# EAGLE design FabEEG_v6 (EAGLE 6.2)
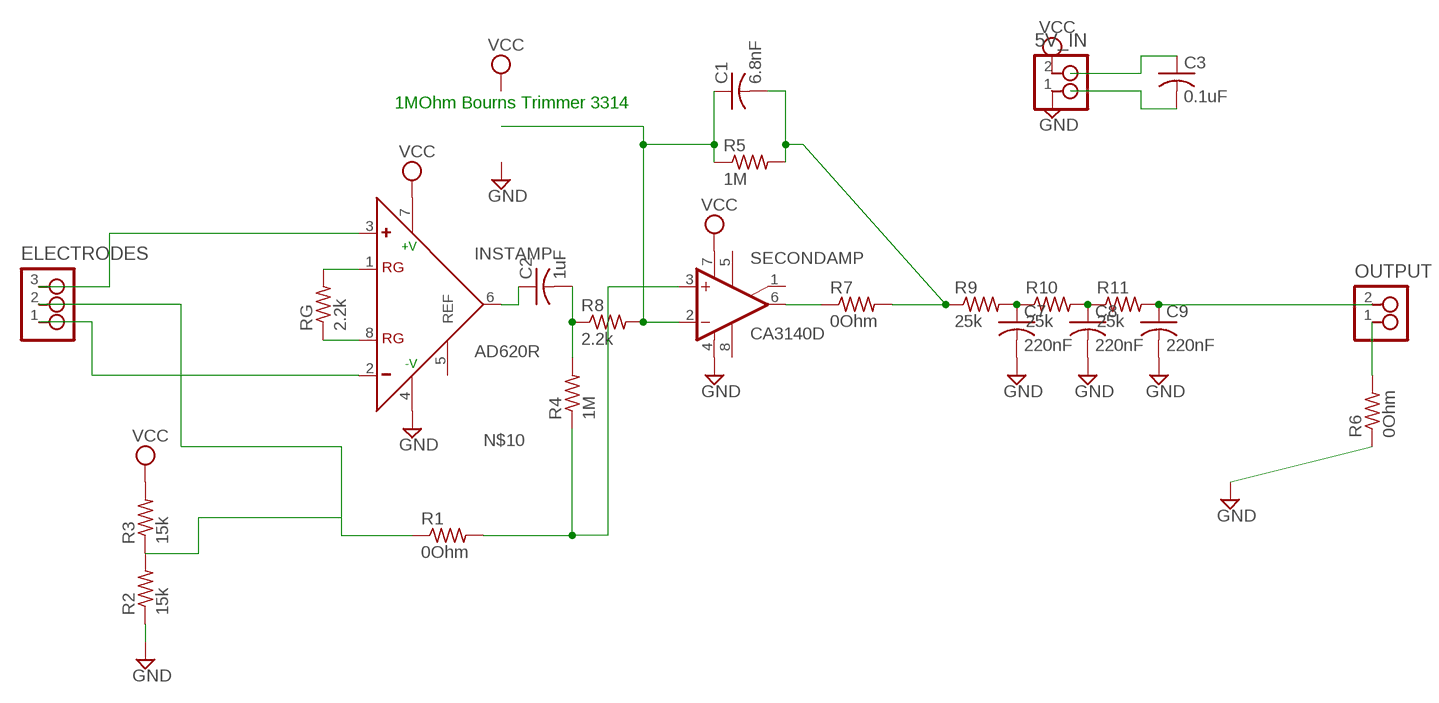
[diagram p0: schematic, sheet 1]

## Parts
5V_IN  2_PIN_HEADERHEADER  [SMT_PINS_2]
C1  6.8nF  C-USC1206  [C1206]
C2  1uF  C-USC1206  [C1206]
C3  0.1uF  C-USC1206  [C1206]
C7  220nF  C-USC1206  [C1206]
C8  220nF  C-USC1206  [C1206]
C9  220nF  C-USC1206  [C1206]
ELECTRODES  3_PIN_HEADERHEADER  [SMT_PINS_3]
INSTAMP  AD620R  [SO8]
OUTPUT  2_PIN_HEADERHEADER  [SMT_PINS_2]
R1  0Ohm  R-US_R1206  [R1206]
R2  15k  R-US_R1206  [R1206]
R3  15k  R-US_R1206  [R1206]
R4  1M  R-US_R1206  [R1206]
R5  1M  R-US_R1206  [R1206]
R6  0Ohm  R-US_R1206  [R1206]
R7  0Ohm  R-US_R1206  [R1206]
R8  2.2k  R-US_R1206  [R1206]
R9  25k  R-US_R1206  [R1206]
R10  25k  R-US_R1206  [R1206]
R11  25k  R-US_R1206  [R1206]
RG  2.2k  R-US_R1206  [R1206]
SECONDAMP  CA3140D  [SO08]

## Nets
GND: 5V_IN.1 C7.2 C8.2 C9.2 INSTAMP.4(-V) R2.1 R6.1 SECONDAMP.4(V-)
N$1: INSTAMP.1(RG) RG.2
N$2: INSTAMP.8(RG) RG.1
N$3: ELECTRODES.3 INSTAMP.3(+)
N$4: C1.2 R5.2 R7.2 R9.1
N$5: C1.1 R5.1 R8.2 SECONDAMP.2(-IN)
N$8: C2.1 INSTAMP.6(OUT)
N$9: C2.2 R4.2 R8.1
N$10: R1.2 R4.1 SECONDAMP.3(+IN)
N$12: C7.1 R9.2 R10.1
N$15: ELECTRODES.1 INSTAMP.2(-)
N$17: OUTPUT.1 R6.2
N$18: R7.1 SECONDAMP.6(OUT)
N$20: C8.1 R10.2 R11.1
N$21: C3.1
N$22: C3.2
N$25: C9.1 OUTPUT.2 R11.2
VCC: 5V_IN.2 INSTAMP.7(+V) R3.2 SECONDAMP.7(V+)
VIRT_GND: ELECTRODES.2 R1.1 R2.2 R3.1
Unconnected: INSTAMP.5(REF) SECONDAMP.1(ON/CMP) SECONDAMP.5(ON) SECONDAMP.8(CMP)

## Notes on the sheet
- 1MOhm Bourns Trimmer 3314

## Library data of the parts
5V_IN OUTPUT = ng:2_PIN_HEADER: 2 SMT pin pads
C1 C2 C7-C9 = rcl:C-US: CAPACITOR, American symbol
C3 = resistor:C-US: CAPACITOR, American symbol
ELECTRODES = ng:3_PIN_HEADER: 3 SMT pin pads
INSTAMP = analog-devices:AD620: Low Cost, Low Power, Instrumentation Amplifier Source: http://www.analog.com/UploadedFiles/Data_Sheets/37793330023930AD620_e.pdf
R1-R11 RG = resistor:R-US_: RESISTOR, American symbol
SECONDAMP = linear:CA3140: OP AMP

## Net classes
0 default: drill 0.813 mm

## Board
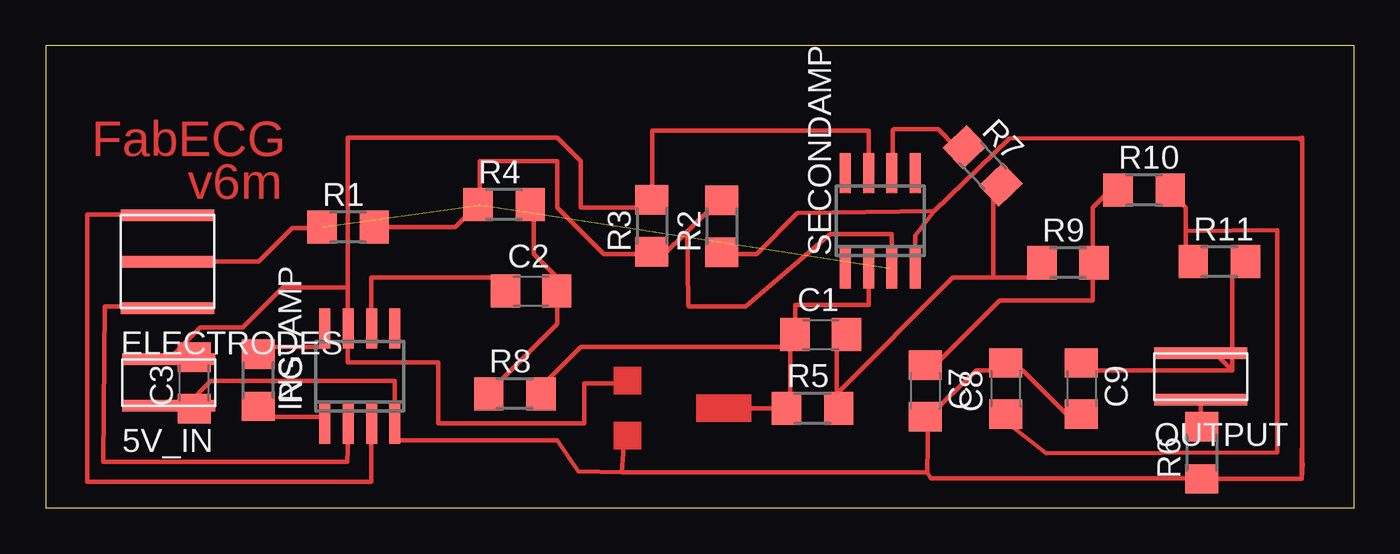
[diagram p1: board, top side]

Size 71.38 x 25.23 mm. Coordinates in mm from the lower left corner, seen from the top.
Outline: 0,0 71.38,0 71.38,25.23 0,25.23 0,0
Copper layers (1*16): Top 0.035mm / dielectric 1.5mm / Bottom 0.035mm
Design rules: minimum track width 12mil, minimum drill 0.8mm, track to track 15.5mil, track to pad 15.5mil, pad to pad 15mil, via to via 15mil, smd to smd 10mil, copper to edge 0mil, drill to drill 1mm, minimum pad ring 0.2mm, minimum via ring 0.2mm, stop-mask expansion 4mil, vias tented up to drill 0mil, thermal gap 1mm

### Footprints (pad centres in the part's own frame; a part is rotated, then mirrored left to right if it is on the bottom)
SMT_PINS_2 = smd 5.08 x 0.635: 1 0,0; 2 0,2.54
C1206 = smd 1.6 x 1.8: 1 -1.4,0; 2 1.4,0
SMT_PINS_3 = smd 5.08 x 0.635: 1 0,0; 2 0,2.54; 3 0,5.08
SO8 = smd 0.6 x 2.2: 1 -1.905,-2.6; 2 -0.635,-2.6; 3 0.635,-2.6; 4 1.905,-2.6; 5 1.905,2.6; 6 0.635,2.6; 7 -0.635,2.6; 8 -1.905,2.6
R1206 = smd 1.6 x 1.803: 1 -1.422,0; 2 1.422,0
SO08 = smd 0.6 x 2.2: 1 -1.905,-2.6; 2 -0.635,-2.6; 3 0.635,-2.6; 4 1.905,-2.6; 5 1.905,2.6; 6 0.635,2.6; 7 -0.635,2.6; 8 -1.905,2.6

### Placement (x,y rotation side)
5V_IN  6.7,5.57 0 top
C1  42.27,9.45 0 top
C2  26.47,11.83 0 top
C3  8.09,6.81 90 top
C7  47.98,6.38 270 top
C8  52.38,6.51 90 top
C9  56.5,6.51 270 top
ELECTRODES  6.64,10.9 0 top
INSTAMP  17.13,7.19 0 top
OUTPUT  63.01,5.9 0 top
R1  16.5,15.32 0 top
R2  36.87,15.37 90 top
R3  33.07,15.39 90 top
R4  25,16.55 0 top
R5  41.84,5.43 0 top
R6  63.06,3 90 top
R7  51.12,18.67 313.6 top
R8  25.59,6.23 0 top
R9  55.77,13.38 0 top
R10  59.92,17.35 0 top
R11  64.02,13.43 0 top
RG  11.59,6.96 270 top
SECONDAMP  45.52,15.67 0 top

### Tracks (layer width: path | path; a pad name or v marks a point on that pad's centre or on a via)
GND
  Top 0.254: 48.15,4.96 50.76,7.5 52.03,7.5 | 52.03,7.5 53.3,7.5 55.84,4.96 C9.2 | 52.03,7.5 C8.2 | 68.54,20.02 68.54,2.42 68.57,2.42 68.52,1.58 | 68.54,20.02 68.54,20.2 | 48.15,4.96 48.09,1.94 | 48.09,1.94 48.27,1.61 63.11,1.61 R6.1 68.52,1.58 | R2.1 36.79,13.85 38.77,13.85 41.01,16.08 48.48,16.21 | 48.15,4.96 C7.2 | 48.09,1.94 31.43,1.94 | 31.43,1.94 29.04,1.99 27.9,3.69 19.01,3.69 INSTAMP.4 19.04,6.91 9,6.91 7.66,5.57 5V_IN.1 | 48.48,16.21 52.56,20.15 68.39,20.17 68.54,20.02 | SECONDAMP.4 47.43,14.86 48.48,16.21 | 31.56,3.71 31.43,1.94 | 68.52,1.58 68.52,3.21
N$1
  Top 0.254: RG.2 11.39,4.96 15.2,4.96 INSTAMP.1
N$2
  Top 0.254: RG.1 11.39,8.77 15.2,8.77 INSTAMP.8
N$3
  Top 0.254: INSTAMP.3 17.77,1.4 2.27,1.4 2.27,16.01 6.64,16.01 ELECTRODES.3
N$4
  Top 0.254: 43.14,6.23 43.14,8.77 C1.2 | 51.68,12.58 49.49,12.58 43.14,6.23 | 51.68,12.58 54.57,12.58 R9.1 | 43.14,6.23 R5.2 | R7.2 51.68,17.22 51.68,12.58
N$5
  Top 0.254: 40.6,8.77 40.6,6.23 R5.1 | 40.6,8.77 29.17,8.77 26.63,6.23 R8.2 | 40.6,8.77 C1.1 40.88,11.08 44.89,11.08 SECONDAMP.2
N$6
  Top 0.254: 16.52,9.71 16.47,9.71 16.47,7.93 21.4,7.93 21.4,4.6 29.37,4.6 29.37,6.79 31.56,6.79
N$8
  Top 0.254: C2.1 25.36,12.58 17.74,12.58 17.74,10.04 INSTAMP.6
N$9
  Top 0.254: R4.2 26.63,16.39 26.63,13.85 27.9,12.58 C2.2 27.9,11.31 27.9,10.04 24.09,6.23 R8.1
N$10  (1 unrouted)
  Top 0.254: R1.2 22.35,15.32 R4.1
N$12
  Top 0.254: C7.1 48.22,7.5 52.03,11.31 57.11,11.31 57.11,12.58 R9.2 57.11,13.85 57.11,16.39 58.38,17.66 R10.1
N$15
  Top 0.254: INSTAMP.2 16.52,4.59 16.45,2.52 3.14,2.52 3.21,11 6.82,11 ELECTRODES.1
N$17
  Top 0.254: R6.2 63.01,4.42 OUTPUT.1
N$18
  Top 0.254: SECONDAMP.6 46.21,18.27 46.21,20.63 46.27,20.68 48.68,20.68 49.66,19.7 R7.1
N$19
  Top 0.254: 38.14,5.42 40.22,5.42
N$20
  Top 0.254: 62.19,15.12 67.17,15.17 67.17,3.03 54.57,2.98 52.03,4.96 C8.1 | 62.19,15.12 62.19,13.85 R11.1 | 62.19,15.12 62.19,16.39 60.92,17.66 R10.2
N$25
  Top 0.254: 64.73,7.5 57.11,7.5 C9.1 | 64.73,7.5 64.73,12.58 R11.2 | 64.73,7.5 63.79,8.44 OUTPUT.2
VCC
  Top 0.254: 16.47,12.02 16.47,10.04 INSTAMP.7 | 16.47,12.02 16.47,20.2 27.9,20.2 29.17,18.93 29.17,16.39 32.98,16.39 R3.2 33.08,16.82 33.08,20.58 44.89,20.58 SECONDAMP.7 | 5V_IN.2 8.42,9.84 10.73,9.84 12.92,12.02 16.47,12.02
VIRT_GND  (1 unrouted)
  Top 0.254: 32.98,13.85 30.44,13.85 27.9,16.39 27.9,18.93 23.69,18.93 23.69,16.54 | 34.99,15.09 33.69,13.8 32.98,13.85 | 34.99,15.09 36.74,16.79 R2.2 | 32.98,13.85 R3.1 | 34.99,15.09 35.04,11.13 35.06,11 38.19,11 42.79,14.94 46.16,14.94 46.16,13.07 | ELECTRODES.2 11.61,13.44 13.45,15.27 15.02,15.27 R1.1
(copper drawn outside any net)
  shapes: Top area x3

### Text on the board
Top: FabECG | v6m